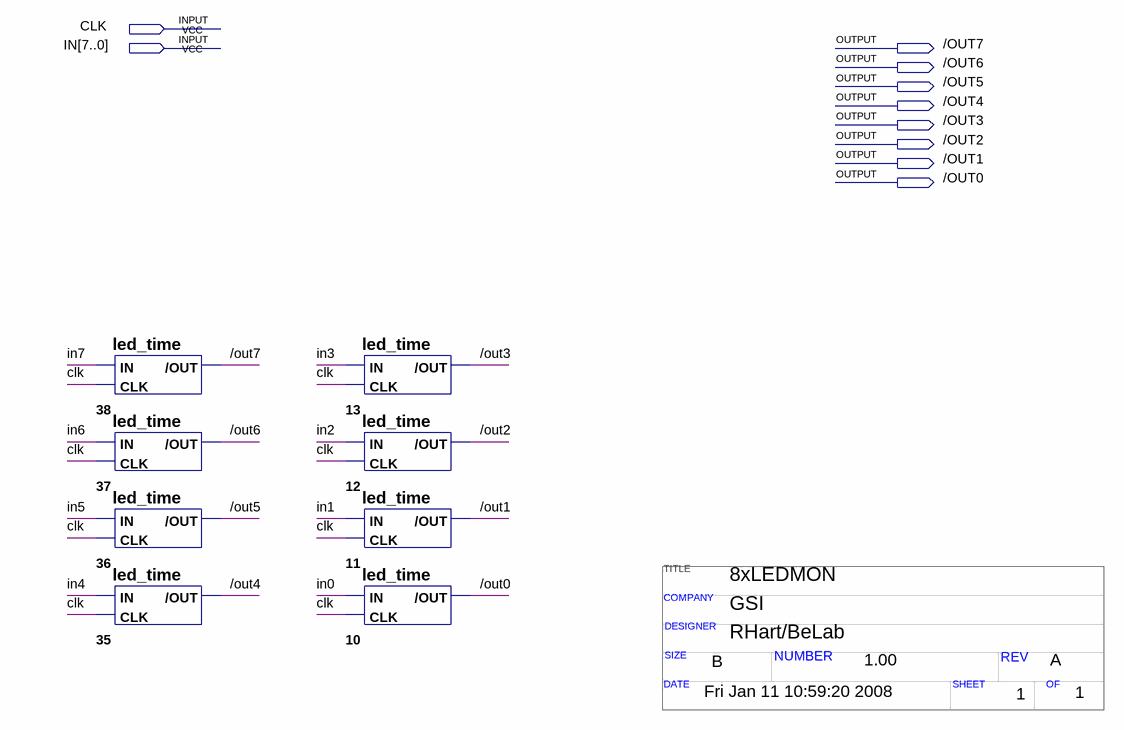
[diagram p0: schematic sheet]
// Quartus schematic 8xledmon.bdf as structural Verilog: 8 symbols, 10 pins
// Title block: TITLE: 8xLEDMON; COMPANY: GSI; DESIGNER: RHart/BeLab; SIZE: B; NUMBER: 1.00; REV: A; DATE: Fri Jan 11 10:59:20 2008; SHEET: 1; OF: 1
module \8xledmon  (
  input  CLK,
  input  [7:0] IN,
  output \/OUT7 ,
  output \/OUT6 ,
  output \/OUT5 ,
  output \/OUT4 ,
  output \/OUT3 ,
  output \/OUT2 ,
  output \/OUT1 ,
  output \/OUT0 
);

  led_time u_38 (.IN(IN[7]), .CLK(CLK), .\/OUT (\/OUT7 ));
  led_time u_37 (.IN(IN[6]), .CLK(CLK), .\/OUT (\/OUT6 ));
  led_time u_36 (.IN(IN[5]), .CLK(CLK), .\/OUT (\/OUT5 ));
  led_time u_35 (.IN(IN[4]), .CLK(CLK), .\/OUT (\/OUT4 ));
  led_time u_13 (.IN(IN[3]), .CLK(CLK), .\/OUT (\/OUT3 ));
  led_time u_12 (.IN(IN[2]), .CLK(CLK), .\/OUT (\/OUT2 ));
  led_time u_11 (.IN(IN[1]), .CLK(CLK), .\/OUT (\/OUT1 ));
  led_time u_10 (.IN(IN[0]), .CLK(CLK), .\/OUT (\/OUT0 ));
endmodule
